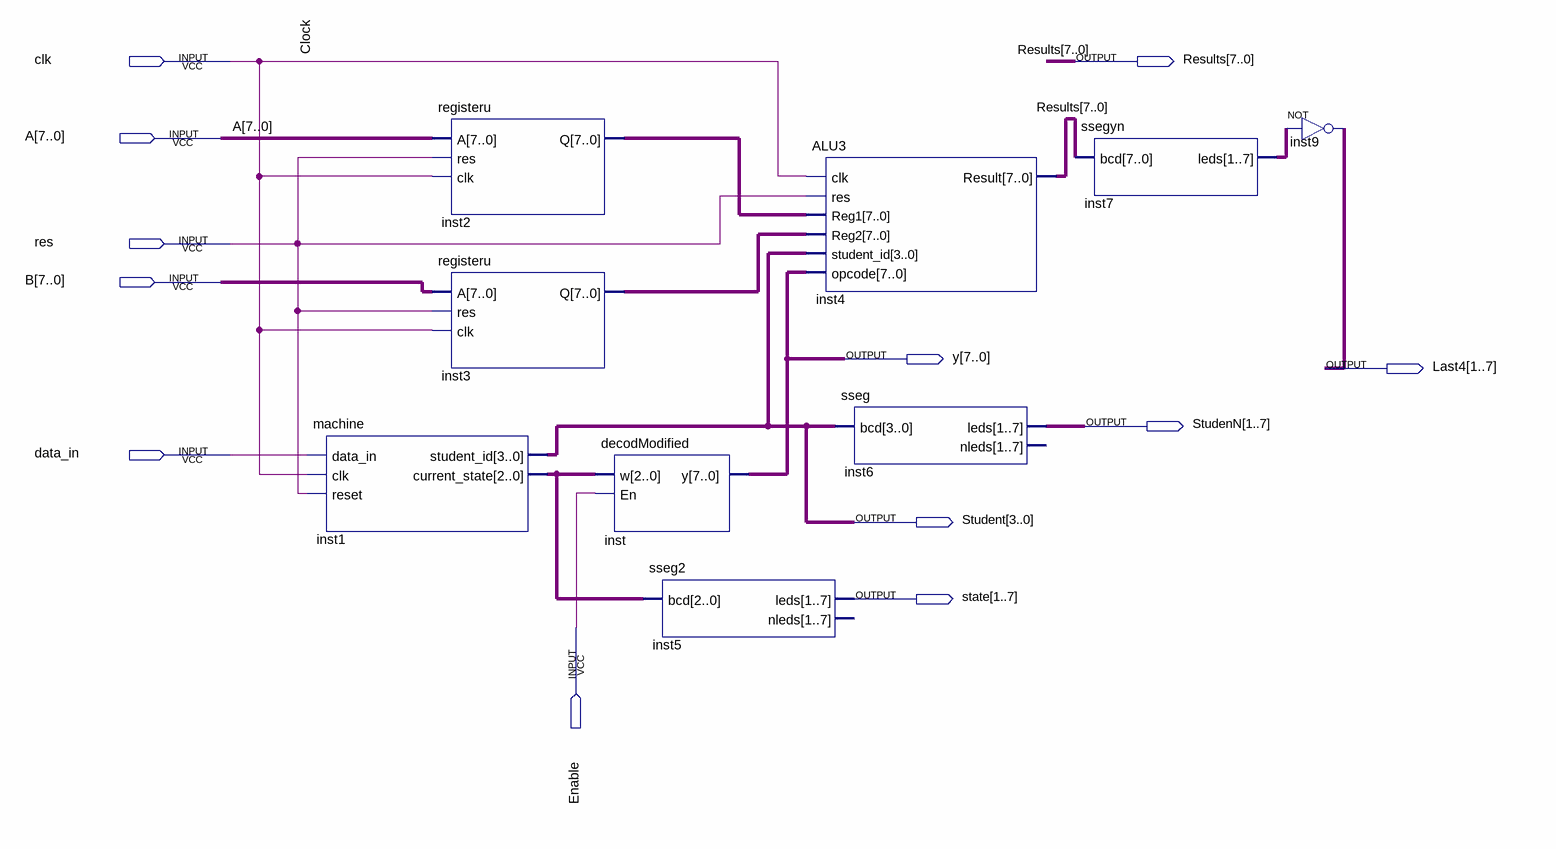
[diagram p0: schematic sheet]
// Quartus schematic CPU3.bdf as structural Verilog: 9 symbols, 12 pins
module CPU3 (
  input  clk,
  input  [7:0] A,
  input  res,
  input  [7:0] B,
  input  data_in,
  input  Enable,
  output [7:0] Results,
  output [7:0] y,
  output [1:7] Last4,
  output [1:7] StudenN,
  output [3:0] Student,
  output [1:7] state
);

  wire [2:0] inst1_current_state;
  wire [6:0] inst7_leds;
  wire [7:0] inst2_q, inst3_q;

  machine inst1 (.data_in(data_in), .clk(clk), .reset(res), .student_id(Student), .current_state(inst1_current_state));
  registeru inst2 (.A(A), .res(res), .clk(clk), .Q(inst2_q));
  registeru inst3 (.A(B), .res(res), .clk(clk), .Q(inst3_q));
  decodModified inst (.w(inst1_current_state), .En(Enable), .y(y));
  sseg2 inst5 (.bcd(inst1_current_state), .leds(state));  // open: nleds
  ALU3 inst4 (.clk(clk), .res(res), .Reg1(inst2_q), .Reg2(inst3_q), .student_id(Student), .opcode(y), .Result(Results));
  sseg inst6 (.bcd(Student), .leds(StudenN));  // open: nleds
  ssegyn inst7 (.bcd(Results), .leds(inst7_leds));
  assign Last4 = ~inst7_leds;  // NOT inst9, 7 bits wide

  // Other names for the same wires on the sheet: Clock = clk
endmodule
